# Altium schematic sheet drv.SchDoc
size A4
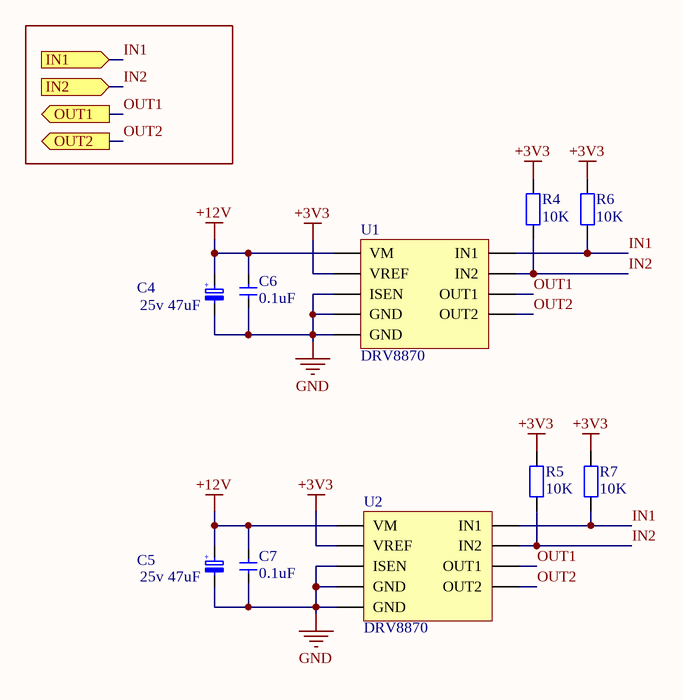
[diagram p0: drv.SchDoc]

## Parts
C4  25v 47uF  [CAP_TANT_D]
C5  25v 47uF  [CAP_TANT_D]
C6  0.1uF  [CAP0805]
C7  0.1uF  [CAP0805]
R4  10K  [RES0805]
R5  10K  [RES0805]
R6  10K  [RES0805]
R7  10K  [RES0805]
U1  DRV8870  [HSOP-8]
U2  DRV8870  [HSOP-8]

## Ports
IN1 (in), IN2 (in), OUT1 (out), OUT2 (out)

## Nets
+3V3: R4.2 R5.2 R6.2 R7.2 U1.4(VREF) U2.4(VREF)
+12V: C4.2(PLUS) C5.2(PLUS) C6.2 C7.2 U1.5(VM) U2.5(VM)
GND: C4.1(MINUS) C5.1(MINUS) C6.1 C7.1 U1.1(GND) U1.7(ISEN) U1.9(GND) U2.1(GND) U2.7(ISEN) U2.9(GND)
IN1: R6.1 R7.1 U1.2(IN1) U2.2(IN1) ; port IN1
IN2: R4.1 R5.1 U1.3(IN2) U2.3(IN2) ; port IN2
OUT1: U1.6(OUT1) U2.6(OUT1) ; port OUT1
OUT2: U1.8(OUT2) U2.8(OUT2) ; port OUT2

## Notes on the sheet
- (in symbol CAP Tantal) +

## Library data of the parts
C4 C5 = CAP Tantal: Tantal SMD Cap
C6 C7 = CAP Ceramic: Ceramic SMD Cap
R4-R7 = RES: RES smd
U1 U2 = DRV8870: DC motor driver 3.6A